# Altium schematic sheet and08479_Individual.SchDoc
size A; SheetNumber: 1; SheetTotal: 1
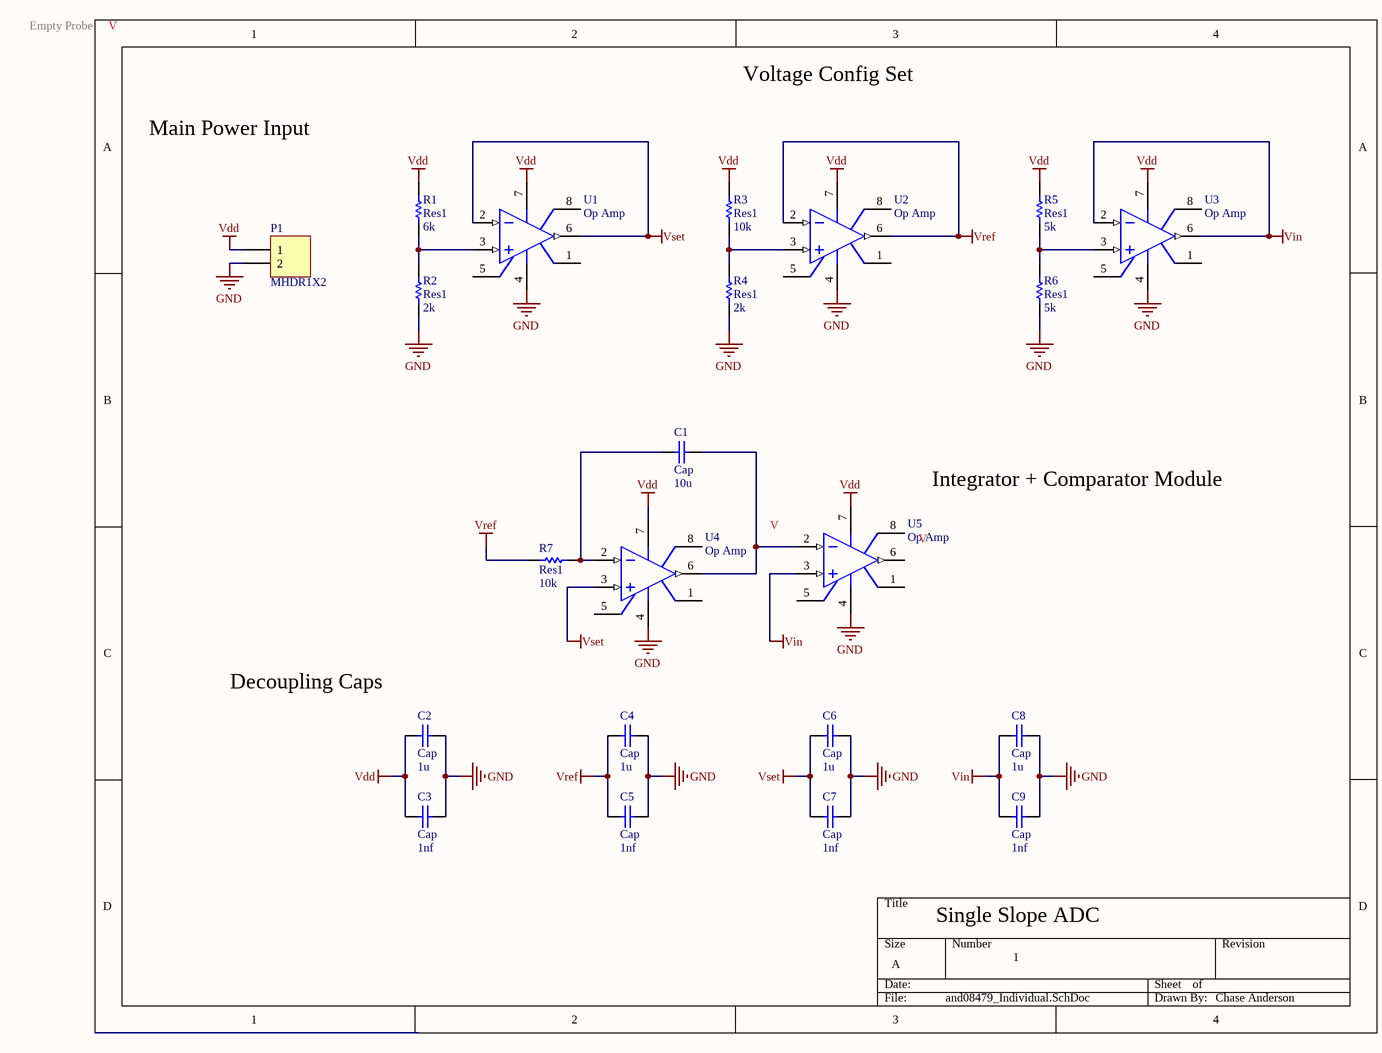
[diagram p0: and08479_Individual.SchDoc]

## Parts
C1  Cap  value 10u  [RAD-0.3]
C2  Cap  value 1u  [RAD-0.3]
C3  Cap  value 1nf  [RAD-0.3]
C4  Cap  value 1u  [RAD-0.3]
C5  Cap  value 1nf  [RAD-0.3]
C6  Cap  value 1u  [RAD-0.3]
C7  Cap  value 1nf  [RAD-0.3]
C8  Cap  value 1u  [RAD-0.3]
C9  Cap  value 1nf  [RAD-0.3]
P1  MHDR1X2  [MHDR1X2]
R1  Res1  value 6k  [AXIAL-0.3]
R2  Res1  value 2k  [AXIAL-0.3]
R3  Res1  value 10k  [AXIAL-0.3]
R4  Res1  value 2k  [AXIAL-0.3]
R5  Res1  value 5k  [AXIAL-0.3]
R6  Res1  value 5k  [AXIAL-0.3]
R7  Res1  value 10k  [AXIAL-0.3]
U1  Op Amp  [H-08A]
U2  Op Amp  [H-08A]
U3  Op Amp  [H-08A]
U4  Op Amp  [H-08A]
U5  Op Amp  [H-08A]

## Nets
GND: C2.2 C3.2 C4.2 C5.2 C6.2 C7.2 C8.2 C9.2 P1.2 R2.1 R4.1 R6.1 U1.4(V-) U2.4(V-) U3.4(V-) U4.4(V-) U5.4(V-)
Vdd: C2.1 C3.1 P1.1 R1.2 R3.2 R5.2 U1.7(V+) U2.7(V+) U3.7(V+) U4.7(V+) U5.7(V+)
Vin: C8.1 C9.1 U3.2(IN-) U3.6(OUT) U5.3(IN+)
Vref: C4.1 C5.1 R7.1 U2.2(IN-) U2.6(OUT)
Vset: C6.1 C7.1 U1.2(IN-) U1.6(OUT) U4.3(IN+)
NetC1_1: C1.1 R7.2 U4.2(IN-)
NetC1_2: C1.2 U4.6(OUT) U5.2(IN-)
NetR1_1: R1.1 R2.2 U1.3(IN+)
NetR3_1: R3.1 R4.2 U2.3(IN+)
NetR5_1: R5.1 R6.2 U3.3(IN+)

Not connected (* = marked no-connect by the designer): U1 1(OS_NUL) 5(OS_NUL) 8(TAB); U2 1(OS_NUL) 5(OS_NUL) 8(TAB); U3 1(OS_NUL) 5(OS_NUL) 8(TAB); U4 1(OS_NUL) 5(OS_NUL) 8(TAB); U5 1(OS_NUL) 5(OS_NUL) 6(OUT) 8(TAB)

## Notes on the sheet
- Voltage Config Set
- Main Power Input
- Integrator + Comparator Module
- (near C2) Decoupling Caps
- Single Slope ADC
- 1
- Chase Anderson

## Library data of the parts
C1-C9 = Cap: Capacitor; Published: 8-Jun-2000; LatestRevisionDate: 17-Jul-2002; LatestRevisionNote: Re-released for DXP Platform.; PackageReference: RAD-0.3; Publisher: Altium Limited; PackageDescription: Radial Cap, Thru-Hole; 2 Leads; 0.3 in Pin Spacing
P1 = MHDR1X2: Header, 2-Pin; LatestRevisionDate: 17-Jul-2002; LatestRevisionNote: Re-released for DXP Platform.; Publisher: Altium Limited
R1-R7 = Res1: Resistor; Published: 8-Jun-2000; LatestRevisionDate: 17-Jul-2002; LatestRevisionNote: Re-released for DXP Platform.; PackageReference: AXIAL-0.3; Publisher: Altium Limited; PackageDescription: Axial Device, Thru-Hole; 2 Leads; 0.3 in Pin Spacing
U1-U5 = Op Amp: FET Operational Amplifier; Published: 8-Jun-2000; LatestRevisionDate: 17-Jul-2002; LatestRevisionNote: Re-released for DXP Platform.; DatasheetVersion: REV. B; PackageVersion: 1990; PackageReference: H-08A; Publisher: Altium Limited; PackageDescription: Can; 8 Leads; Pin Circle Dia. 5.08 mm; Lead Dia. 0.53 mm (max); ComponentLink1Description: Manufacturer Link; ComponentLink1URL: http://www.analog.com/